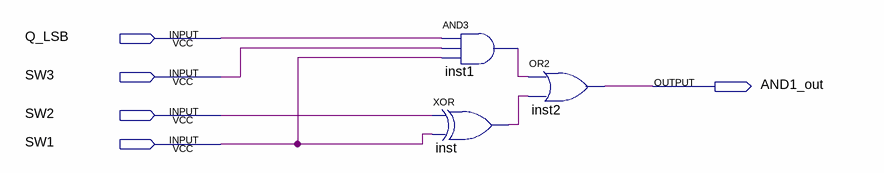
[diagram p0: schematic sheet]
// Quartus schematic and_one.bdf as structural Verilog: 3 symbols, 5 pins
module and_one (
  input  Q_LSB,
  input  SW3,
  input  SW2,
  input  SW1,
  output AND1_out
);

  wire inst1_out, inst_out;

  and inst1 (inst1_out, Q_LSB, SW3, SW1);
  xor inst (inst_out, SW2, SW1);
  or inst2 (AND1_out, inst1_out, inst_out);
endmodule
